# Altium schematic sheet tach key.SchDoc
size A3
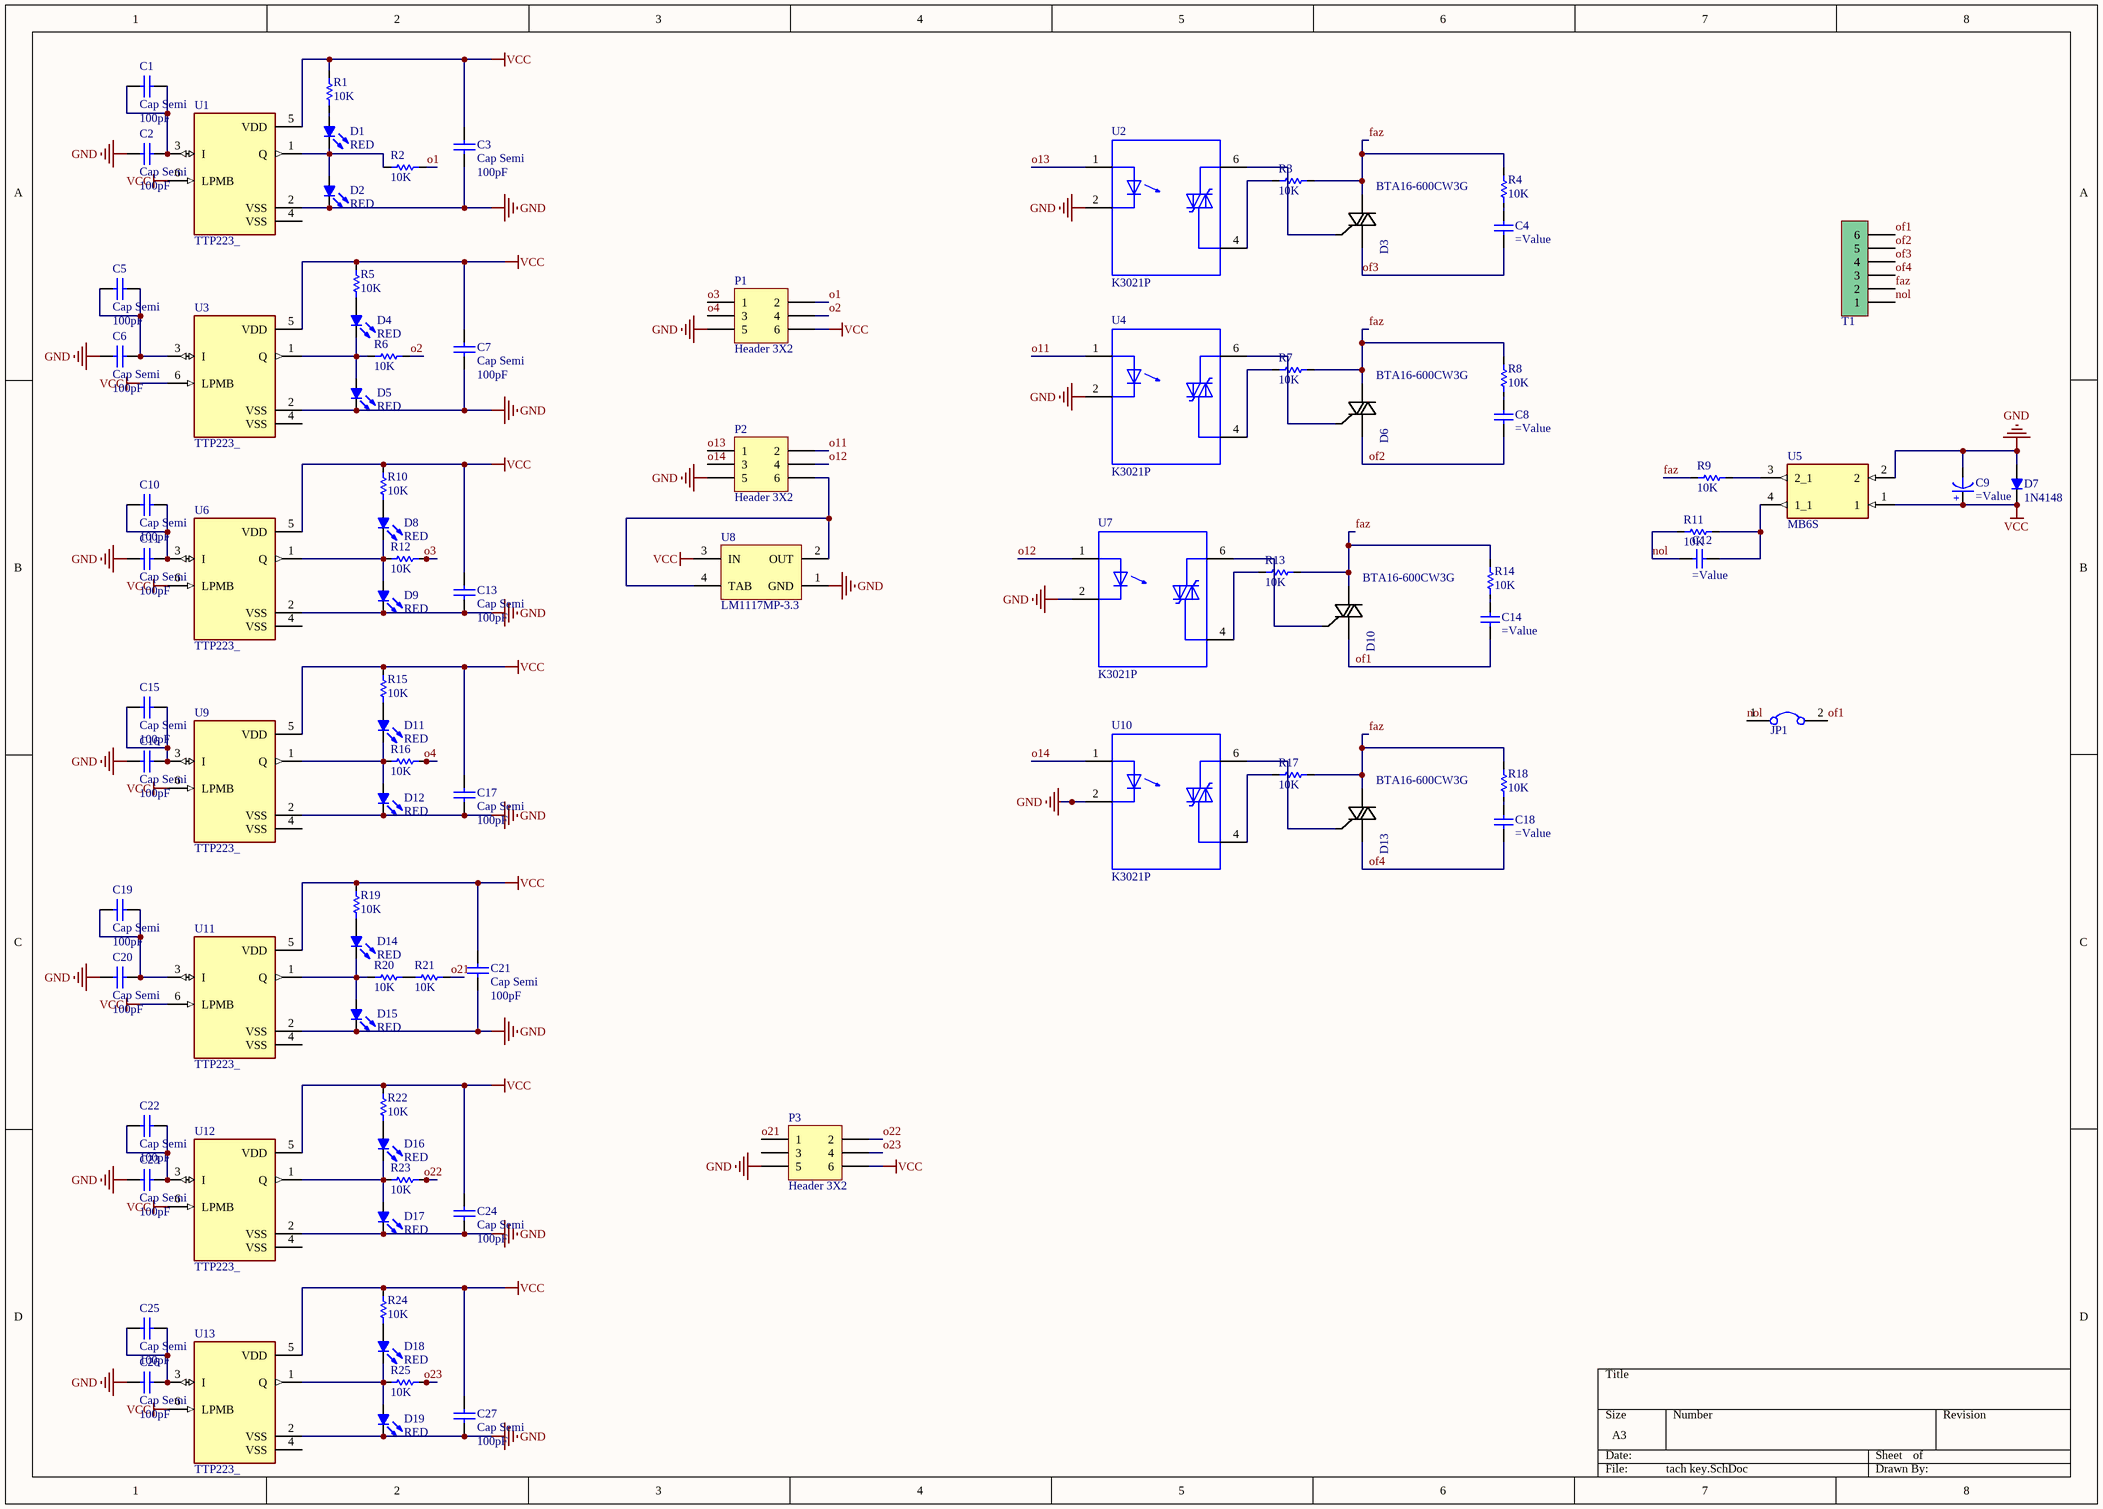
[diagram p0: tach key.SchDoc]

## Parts
C1  Cap Semi  value 100pF  [C1206]
C2  Cap Semi  value 100pF  [C1206]
C3  Cap Semi  value 100pF  [C1206]
C4  (no value)  [CAP-30]
C5  Cap Semi  value 100pF  [C1206]
C6  Cap Semi  value 100pF  [C1206]
C7  Cap Semi  value 100pF  [C1206]
C8  (no value)  [CAP-30]
C9  (no value)  [ELEC-CAP-RAD10-20]
C10  Cap Semi  value 100pF  [C1206]
C11  Cap Semi  value 100pF  [C1206]
C12  (no value)  [CAP-30]
C13  Cap Semi  value 100pF  [C0805]
C14  (no value)  [CAP-30]
C15  Cap Semi  value 100pF  [C1206]
C16  Cap Semi  value 100pF  [C1206]
C17  Cap Semi  value 100pF  [C0805]
C18  (no value)  [CAP-30]
C19  Cap Semi  value 100pF  [C1206]
C20  Cap Semi  value 100pF  [C1206]
C21  Cap Semi  value 100pF  [C1206]
C22  Cap Semi  value 100pF  [C1206]
C23  Cap Semi  value 100pF  [C1206]
C24  Cap Semi  value 100pF  [C0805]
C25  Cap Semi  value 100pF  [C1206]
C26  Cap Semi  value 100pF  [C1206]
C27  Cap Semi  value 100pF  [C0805]
D1  COLOR: RED  [RES 0805 (2012X06L)]  (hidden comment: MODEL)
D2  COLOR: RED  [RES 0805 (2012X06L)]  (hidden comment: MODEL)
D3  BTA16-600CW3G  [*TO254P1028X482X1968-3]
D4  COLOR: RED  [RES 0805 (2012X06L)]  (hidden comment: MODEL)
D5  COLOR: RED  [RES 0805 (2012X06L)]  (hidden comment: MODEL)
D6  BTA16-600CW3G  [*TO254P1028X482X1968-3]
D7  MODEL: 1N4148  [DO-35-STAND]  (hidden comment: MODEL)
D8  COLOR: RED  [RES 0805 (2012X06L)]  (hidden comment: MODEL)
D9  COLOR: RED  [RES 0805 (2012X06L)]  (hidden comment: MODEL)
D10  BTA16-600CW3G  [*TO254P1028X482X1968-3]
D11  COLOR: RED  [RES 0805 (2012X06L)]  (hidden comment: MODEL)
D12  COLOR: RED  [RES 0805 (2012X06L)]  (hidden comment: MODEL)
D13  BTA16-600CW3G  [*TO254P1028X482X1968-3]
D14  COLOR: RED  [RES 0805 (2012X06L)]  (hidden comment: MODEL)
D15  COLOR: RED  [RES 0805 (2012X06L)]  (hidden comment: MODEL)
D16  COLOR: RED  [RES 0805 (2012X06L)]  (hidden comment: MODEL)
D17  COLOR: RED  [RES 0805 (2012X06L)]  (hidden comment: MODEL)
D18  COLOR: RED  [RES 0805 (2012X06L)]  (hidden comment: MODEL)
D19  COLOR: RED  [RES 0805 (2012X06L)]  (hidden comment: MODEL)
JP1  Jumper  [Header 2X1]  (value not drawn)
P1  Header 3X2  [HDR2X3]
P2  Header 3X2  [MHDR2X3]
P3  Header 3X2  [MHDR2X3]
R1  10K  [RES 1206 (3216X08L)]
R2  10K  [RES 1206 (3216X08L)]
R3  10K  [RES 1206 (3216X08L)]
R4  10K  [RES 1206 (3216X08L)]
R5  10K  [RES 1206 (3216X08L)]
R6  10K  [RES 1206 (3216X08L)]
R7  10K  [RES 1206 (3216X08L)]
R8  10K  [RES 1206 (3216X08L)]
R9  10K  [Res-(2/1)]
R10  10K  [RES 1206 (3216X08L)]
R11  10K  [Res-(1/4)]
R12  10K  [RES 1206 (3216X08L)]
R13  10K  [RES 1206 (3216X08L)]
R14  10K  [RES 1206 (3216X08L)]
R15  10K  [RES 1206 (3216X08L)]
R16  10K  [RES 1206 (3216X08L)]
R17  10K  [RES 1206 (3216X08L)]
R18  10K  [RES 1206 (3216X08L)]
R19  10K  [RES 1206 (3216X08L)]
R20  10K  [RES 1206 (3216X08L)]
R21  10K  [RES 1206 (3216X08L)]
R22  10K  [RES 1206 (3216X08L)]
R23  10K  [RES 1206 (3216X08L)]
R24  10K  [RES 1206 (3216X08L)]
R25  10K  [RES 1206 (3216X08L)]
T1  Phoenix terminal  [phoenix terminal 6]  (value not drawn)
U1  TTP223_  [SOT95P285X126-6N]
U2  K3021P  [DIP762W50P254L730H410Q6]
U3  TTP223_  [SOT95P285X126-6N]
U4  K3021P  [DIP762W50P254L730H410Q6]
U5  MB6S  [SOIC245P670X270-4N]
U6  TTP223_  [SOT95P285X126-6N]
U7  K3021P  [DIP762W50P254L730H410Q6]
U8  LM1117MP-3.3  [MP04A_N]
U9  TTP223_  [SOT95P285X126-6N]
U10  K3021P  [DIP762W50P254L730H410Q6]
U11  TTP223_  [SOT95P285X126-6N]
U12  TTP223_  [SOT95P285X126-6N]
U13  TTP223_  [SOT95P285X126-6N]

## Nets
GND: C2.2 C3.1 C6.2 C7.1 C9.1(-) C11.2 C13.1 C16.2 C17.1 C20.2 C21.1 C23.2 C24.1 C26.2 C27.1 D2.2(K) D5.2(K) D7.1(A) D9.2(K) D12.2(K) D15.2(K) D17.2(K) D19.2(K) P1.5 P2.5 P3.5 U1.2(VSS) U2.2(C) U3.2(VSS) U4.2(C) U5.2 U6.2(VSS) U7.2(C) U8.1(GND) U9.2(VSS) U10.2(C) U11.2(VSS) U12.2(VSS) U13.2(VSS)
VCC: C3.2 C7.2 C9.2(+) C13.2 C17.2 C21.2 C24.2 C27.2 D7.2(K) P1.6 P3.6 R1.2 R5.2 R10.2 R15.2 R19.2 R22.2 R24.2 U1.5(VDD) U1.6(LPMB) U3.5(VDD) U3.6(LPMB) U5.1 U6.5(VDD) U6.6(LPMB) U8.3(IN) U9.5(VDD) U9.6(LPMB) U11.5(VDD) U11.6(LPMB) U12.5(VDD) U12.6(LPMB) U13.5(VDD) U13.6(LPMB)
faz: D3.2(MT2) D6.2(MT2) D10.2(MT2) D13.2(MT2) R3.2 R4.2 R7.2 R8.2 R9.2 R13.2 R14.2 R17.2 R18.2 T1.2
nol: C12.1(+) JP1.1 R11.2 T1.1
o1: P1.2 R2.2
o2: P1.4 R6.2
o3: P1.1 R12.2
o4: P1.3 R16.2
o11: P2.2 U4.1(A)
o12: P2.4 U7.1(A)
o13: P2.1 U2.1(A)
o14: P2.3 U10.1(A)
o21: P3.1 R21.2
o22: P3.2 R23.2
o23: P3.4 R25.2
of1: C14.1(+) D10.1(MT1) JP1.2 T1.6
of2: C8.1(+) D6.1(MT1) T1.5
of3: C4.1(+) D3.1(MT1) T1.4
of4: C18.1(+) D13.1(MT1) T1.3
NetC1_1: C1.1 C1.2 C2.1 U1.3(I)
NetC4_2: C4.2(-) R4.1
NetC5_1: C5.1 C5.2 C6.1 U3.3(I)
NetC8_2: C8.2(-) R8.1
NetC10_1: C10.1 C10.2 C11.1 U6.3(I)
NetC12_2: C12.2(-) R11.1 U5.4(1_1)
NetC14_2: C14.2(-) R14.1
NetC15_1: C15.1 C15.2 C16.1 U9.3(I)
NetC18_2: C18.2(-) R18.1
NetC19_1: C19.1 C19.2 C20.1 U11.3(I)
NetC22_1: C22.1 C22.2 C23.1 U12.3(I)
NetC25_1: C25.1 C25.2 C26.1 U13.3(I)
NetD1_1: D1.1(A) R1.1
NetD1_2: D1.2(K) D2.1(A) R2.1 U1.1(Q)
NetD3_3: D3.3(G) U2.6(MT2)
NetD4_1: D4.1(A) R5.1
NetD4_2: D4.2(K) D5.1(A) R6.1 U3.1(Q)
NetD6_3: D6.3(G) U4.6(MT2)
NetD8_1: D8.1(A) R10.1
NetD8_2: D8.2(K) D9.1(A) R12.1 U6.1(Q)
NetD10_3: D10.3(G) U7.6(MT2)
NetD11_1: D11.1(A) R15.1
NetD11_2: D11.2(K) D12.1(A) R16.1 U9.1(Q)
NetD13_3: D13.3(G) U10.6(MT2)
NetD14_1: D14.1(A) R19.1
NetD14_2: D14.2(K) D15.1(A) R20.1 U11.1(Q)
NetD16_1: D16.1(A) R22.1
NetD16_2: D16.2(K) D17.1(A) R23.1 U12.1(Q)
NetD18_1: D18.1(A) R24.1
NetD18_2: D18.2(K) D19.1(A) R25.1 U13.1(Q)
NetP2_6: P2.6 U8.2(OUT) U8.4(TAB)
NetR3_1: R3.1 U2.4(MT1)
NetR7_1: R7.1 U4.4(MT1)
NetR9_1: R9.1 U5.3(2_1)
NetR13_1: R13.1 U7.4(MT1)
NetR17_1: R17.1 U10.4(MT1)
NetR20_2: R20.2 R21.1

Not connected (* = marked no-connect by the designer): P3 3; U1 4(VSS); U3 4(VSS); U6 4(VSS); U9 4(VSS); U11 4(VSS); U12 4(VSS); U13 4(VSS)

## Library data of the parts
C1-C3 C5-C7 C10 C11 C13 C15-C17 C19-C27 = Cap Semi: Capacitor (Semiconductor SIM Model); Published: 8-Jun-2000; LatestRevisionDate: 29-May-2009; LatestRevisionNote: IPC-7351 Footprint Added.; PackageReference: C1206; Publisher: Altium Limited; PackageDescription: Chip Capacitor
C4 C8 C12 C14 C18 = Capacitor
C9 = Capacitor Electrolytic: Electrolytic Capacitor
D1 D2 D4 D5 D8 D9 D11 D12 D14-D19 = LED 5mm: Typical LED
D3 D6 D10 D13 = BTA16-600CW3G: TRIAC Standard 600V 16A Through Hole TO-220AB; MF: Littelfuse Inc.; Package: TO-220 ON Semiconductor; SnapEDA_Link: https://www.snapeda.com/parts/BTA16-600CW3G/Littelfuse%20Inc./view-part/390940/?ref=snap; Mouser-Purchase-URL: https://snapeda.com/shop?store=Mouser&id=390940; DigiKey-Purchase-URL: https://snapeda.com/shop?store=DigiKey&id=390940; Price: None; Arrow_Americas-Purchase-URL: https://snapeda.com/shop?store=Arrow+Americas&id=390940; Availability: Unavailable; MP: BTA16-600CW3G; Value: *
D7 = Diode
P1-P3 = Header 3X2: Header, 3-Pin, Dual row; LatestRevisionDate: 17-Jul-2002; LatestRevisionNote: Re-released for DXP Platform.; Publisher: Altium Limited
R1-R25 = Resistor: Tolerance: 5%; Power: 1/4 W; Value: 10K
T1 = Phoenix terminal 6: Terminal 6 Pin; Designer: Seyed Mohsen Ghasemain; E-mail: picpars@gmail.com; ComponentLinkURL: www.picpars.com
U1 U3 U6 U9 U11-U13 = TTP223_: 22 kOhms Â±5% 0.1W, 1/10W Chip Resistor 0402 _1005 Metric_ Automotive AEC-Q200, Moisture Resistant Thick Film; MP: TTP223; MF: KOA Speer; Price: None; SnapEDA_Link: https://www.snapeda.com/parts/TTP223%20/KOA%20Speer/view-part/2780209/?ref=snap; Package: 0402 KOA Speer; Availability: Unavailable; Value: *
U2 U4 U7 U10 = K3021P: Optoisolator Triac Output 5300Vrms 1 Channel 6-DIP; MF: Vishay Semiconductor; Package: DIP-6 Vishay; Availability: Unavailable; Value: *; MP: K3021P; Mouser-Purchase-URL: https://snapeda.com/shop?store=Mouser&id=291595; SnapEDA_Link: https://www.snapeda.com/parts/K3021P/Vishay%20Semiconductor%20Opto%20Division/view-part/291595/?ref=snap; Price: None; DigiKey-Purchase-URL: https://snapeda.com/shop?store=DigiKey&id=291595
U5 = MB6S: Bridge Rectifier Single Phase Standard 600V Surface Mount 4-SOIC; MF: ON Semiconductor; Digi-Key_Purchase_URL: https://www.digikey.com.tr/product-detail/en/on-semiconductor/MB6S/MB6SCT-ND/965654?utm_source=snapeda&utm_medium=aggregator&utm_campaign=symbol; Value: *; Package: BESOP-4 Surge Components; Digi-Key_Part_Number: MB6SCT-ND; SnapEDA_Link: https://www.snapeda.com/parts/MB6S/ON%20Semiconductor/view-part/2774209/?ref=snap; MP: MB6S
U8 = LM1117MP-3.3: 800mA Low-Dropout Linear Regulator; Manufacturer: National Semiconductor; CompType: LDO IC; PackageTopMarking: XYTT*N05A; PowerWise: N; Published: 4-Dec-2008; DatasheetVersion: Apr-2006; PackageVersion: revB, Apr-2003; PackageReference: MP04A; Publisher: Altium Limited; PackageDescription: Molded SOT-223, 6.50 x 3.56 x 1.6mm Body, 4 Lead, 2.3mm Pitch; PartNumber: LM1117MP-3.3; RoHS: O; PinCount: 4; DigiKeyPartNumber: LM1117MP-3.3CT-ND; Code_JEDEC: TO-261-AA; Code_IPC: SOT223-4; ComponentLink1Description: LM1117 Datasheet; ComponentLink1URL: http://www.national.com/ds/LM/LM1117.pdf; ComponentLink2Description: LM1117 Web Page; ComponentLink2URL: http://www.national.com/pf/LM/LM1117.html; ComponentLink3Description: MP04A Package Page; ComponentLink3URL: http://www.national.com/packaging/folders/mp04a.html